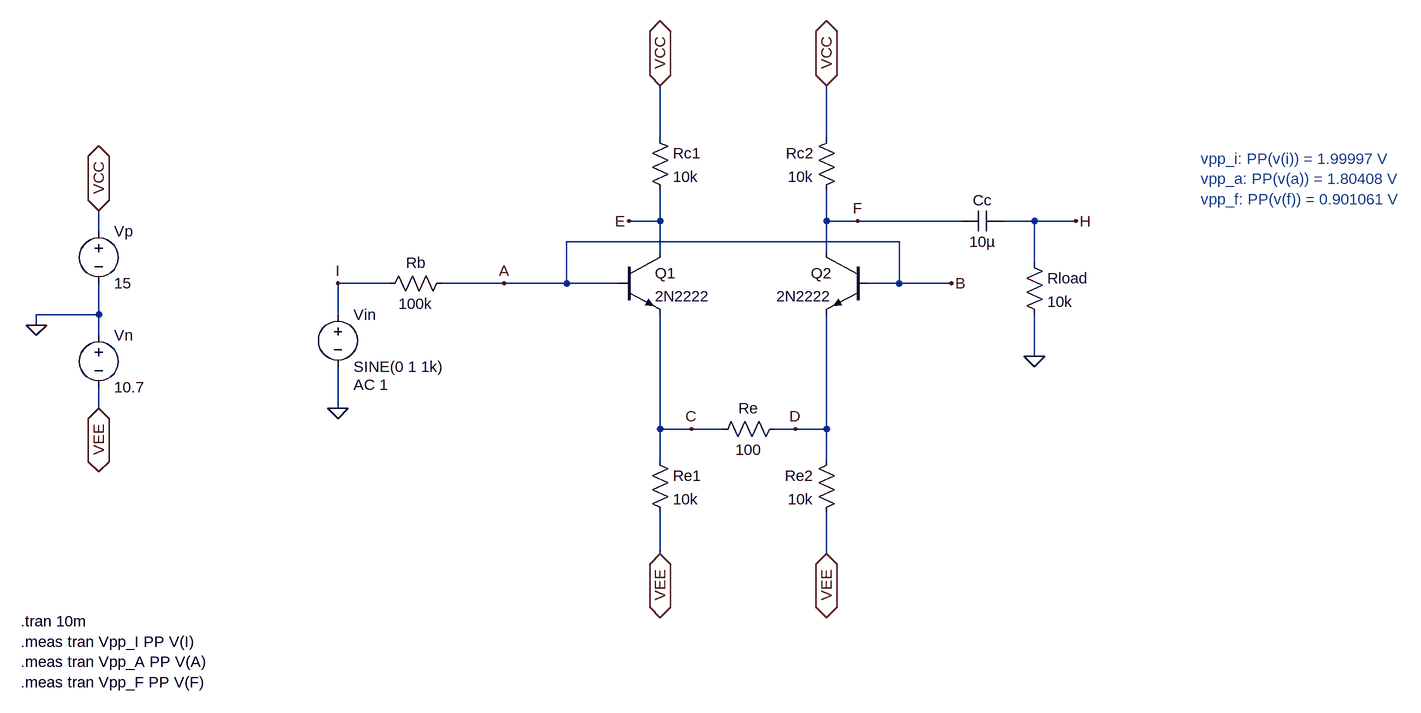
[diagram p0: schematic e2_1.asc]
e2_1.asc, the LTspice schematic file:
Version 4
SHEET 1 2088 844
WIRE 912 0 912 -80
WIRE 1168 0 1168 -80
WIRE 912 128 912 80
WIRE 912 128 864 128
WIRE 1168 128 1168 80
WIRE 1216 128 1168 128
WIRE 1376 128 1216 128
WIRE 1488 128 1440 128
WIRE 1552 128 1488 128
WIRE 48 144 48 112
WIRE 1280 160 768 160
WIRE 912 176 912 128
WIRE 1168 176 1168 128
WIRE 1488 192 1488 128
WIRE 496 224 416 224
WIRE 672 224 576 224
WIRE 768 224 768 160
WIRE 768 224 672 224
WIRE 848 224 768 224
WIRE 1280 224 1280 160
WIRE 1280 224 1232 224
WIRE 1360 224 1280 224
WIRE 48 272 48 224
WIRE 48 272 -48 272
WIRE 416 272 416 224
WIRE -48 288 -48 272
WIRE 48 304 48 272
WIRE 1488 336 1488 272
WIRE 48 416 48 384
WIRE 416 416 416 352
WIRE 912 448 912 272
WIRE 960 448 912 448
WIRE 1008 448 960 448
WIRE 1120 448 1088 448
WIRE 1168 448 1168 272
WIRE 1168 448 1120 448
WIRE 912 496 912 448
WIRE 1168 496 1168 448
WIRE 912 640 912 576
WIRE 1168 640 1168 576
FLAG -48 288 0
FLAG 48 112 VCC
IOPIN 48 112 BiDir
FLAG 48 416 VEE
IOPIN 48 416 BiDir
FLAG 912 -80 VCC
IOPIN 912 -80 BiDir
FLAG 864 128 E
FLAG 672 224 A
FLAG 912 640 VEE
IOPIN 912 640 BiDir
FLAG 960 448 C
FLAG 1168 -80 VCC
IOPIN 1168 -80 BiDir
FLAG 1216 128 F
FLAG 1360 224 B
FLAG 1168 640 VEE
IOPIN 1168 640 BiDir
FLAG 1120 448 D
FLAG 416 416 0
FLAG 416 224 I
FLAG 1488 336 0
FLAG 1552 128 H
SYMBOL voltage 48 128 R0
SYMATTR InstName Vp
SYMATTR Value 15
SYMBOL voltage 48 288 R0
SYMATTR InstName Vn
SYMATTR Value 10.7
SYMBOL npn 848 176 R0
SYMATTR InstName Q1
SYMATTR Value 2N2222
SYMBOL res 896 -16 R0
SYMATTR InstName Rc1
SYMATTR Value 10k
SYMBOL res 896 480 R0
SYMATTR InstName Re1
SYMATTR Value 10k
SYMBOL npn 1232 176 M0
SYMATTR InstName Q2
SYMATTR Value 2N2222
SYMBOL res 1184 -16 M0
SYMATTR InstName Rc2
SYMATTR Value 10k
SYMBOL res 1184 480 M0
SYMATTR InstName Re2
SYMATTR Value 10k
SYMBOL voltage 416 256 R0
WINDOW 123 24 124 Left 2
WINDOW 39 0 0 Left 0
SYMATTR Value2 AC 1
SYMATTR InstName Vin
SYMATTR Value SINE(0 1 1k)
SYMBOL res 592 208 R90
WINDOW 0 0 56 VBottom 2
WINDOW 3 32 56 VTop 2
SYMATTR InstName Rb
SYMATTR Value 100k
SYMBOL res 1104 432 R90
WINDOW 0 0 56 VBottom 2
WINDOW 3 32 56 VTop 2
SYMATTR InstName Re
SYMATTR Value 100
SYMBOL cap 1440 112 R90
WINDOW 0 0 32 VBottom 2
WINDOW 3 32 32 VTop 2
SYMATTR InstName Cc
SYMATTR Value 10µ
SYMBOL res 1472 176 R0
SYMATTR InstName Rload
SYMATTR Value 10k
TEXT -72 744 Left 2 !.tran 10m\n.meas tran Vpp_I PP V(I)\n.meas tran Vpp_A PP V(A)\n.meas tran Vpp_F PP V(F)
TEXT 1744 32 Left 2 ;vpp_i: PP(v(i)) = 1.99997 V\nvpp_a: PP(v(a)) = 1.80408 V\nvpp_f: PP(v(f)) = 0.901061 V

The netlist it stands for:
* e2_1.asc
Vp VCC 0 15
Vn 0 VEE 10.7
Q1 E B C 0 2N2222
Rc1 VCC E 10k
Re1 C VEE 10k
Q2 F B D 0 2N2222
Rc2 VCC F 10k
Re2 D VEE 10k
Vin I 0 SINE(0 1 1k) AC 1
Rb B I 100k
Re D C 100
Cc H F 10µ
Rload H 0 10k
.model NPN NPN
.model PNP PNP
.lib standard.bjt
.tran 10m
.meas tran Vpp_I PP V(I)
.meas tran Vpp_A PP V(A)
.meas tran Vpp_F PP V(F)
* vpp_i: PP(v(i)) = 1.99997 V
* vpp_a: PP(v(a)) = 1.80408 V
* vpp_f: PP(v(f)) = 0.901061 V
.backanno
.end